# EAGLE design OPA1622 - Breakout (EAGLE 6.4)
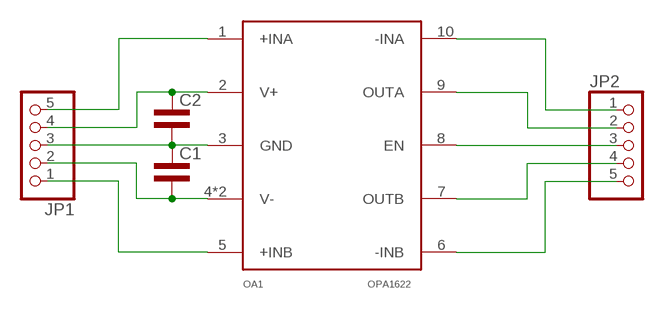
[diagram p0: schematic, sheet 1]

## Parts
C1  CAP0603L3  [0603L3]
C2  CAP0603L3  [0603L3]
JP1  PINHD-1X5  [1X05]
JP2  PINHD-1X5  [1X05]
OA1  OPA1622  [S-PVSON-N10]

## Nets
+INA: JP1.5 OA1.1(+INA)
+INB: JP1.1 OA1.5(+INB)
-INA: JP2.1 OA1.10(-INA)
-INB: JP2.5 OA1.6(-INB)
EN: JP2.3 OA1.8(EN)
GND: C1.P$1 C2.P$2 JP1.3 OA1.3(GND)
OUTA: JP2.2 OA1.9(OUTA)
OUTB: JP2.4 OA1.7(OUTB)
V+: C2.P$1 JP1.4 OA1.2(V+)
V-: C1.P$2 JP1.2 OA1.4(V-) OA1.TP(V-)

## Library data of the parts
C1 C2 = common:CAP
JP1 JP2 = pinhead:PINHD-1X5: PIN HEADER
OA1 = common:OPA1622

## Board
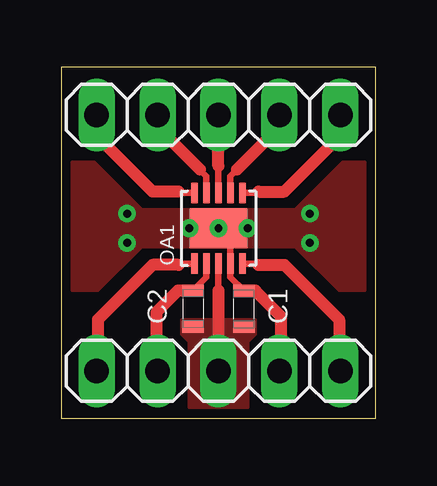
[diagram p1: board, top side]
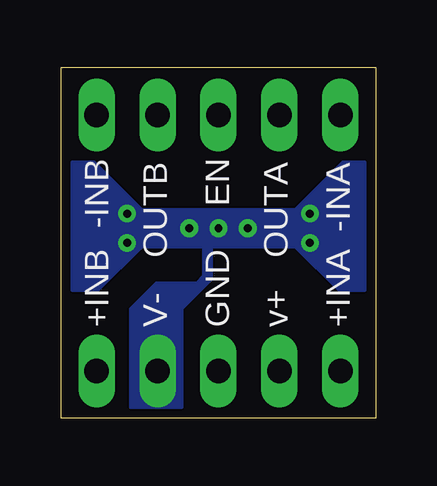
[diagram p2: board, bottom side, seen from below]

Size 13.11 x 14.63 mm. Coordinates in mm from the lower left corner, seen from the top.
Outline: 0,0 13.11,0 13.11,14.63 0,14.63 0,0
Copper layers (1*16): Top 0.035mm / dielectric 1.5mm / Bottom 0.035mm
Design rules "default *": minimum track width 10mil, minimum drill 24mil, track to track 8mil, track to pad 8mil, pad to pad 8mil, via to via 8mil, smd to smd 8mil, copper to edge 13mil, drill to drill 8mil, minimum pad ring 10mil, minimum via ring 8mil, stop-mask expansion 4mil, vias tented up to drill 0mil, thermal gap 10mil

### Footprints (pad centres in the part's own frame; a part is rotated, then mirrored left to right if it is on the bottom)
0603L3 = smd 0.5 x 0.9: P$1 -0.75,0; P$2 0.75,0
1X05 = drill 1.016 long: 1 -5.08,0; 2 -2.54,0; 3 0,0; 4 2.54,0; 5 5.08,0
S-PVSON-N10 = smd 0.28 x 0.85: 1 -1,-1.475; 2 -0.5,-1.475; 3 0,-1.475; 4 0.5,-1.475; 5 1,-1.475; 6 1,1.475; 7 0.5,1.475; 8 0,1.475; 9 -0.5,1.475; 10 -1,1.475 | smd 2.4 x 1.65: TP 0,0

### Placement (x,y rotation side)
C1  7.62,4.57 90 top
C2  5.49,4.57 270 top
JP1  6.55,1.98 180 top
JP2  6.55,12.65 0 top
OA1  6.55,7.92 0 top

### Tracks (layer width: path | path; a pad name or v marks a point on that pad's centre or on a via)
+INA
  Top 0.279: OA1.1 4.93,6.45 4.88,6.4
  Top 0.508: 4.88,6.4 3.81,6.4 1.52,4.12 1.52,2.03 JP1.5
+INB
  Top 0.279: OA1.5 8.18,6.45 8.23,6.4
  Top 0.508: 8.23,6.4 9.3,6.4 11.58,4.12 11.58,2.03 JP1.1
-INA
  Top 0.279: OA1.10 4.93,9.4 4.88,9.45
  Top 0.508: 4.88,9.45 3.81,9.45 1.52,11.74 1.52,12.6 JP2.1
-INB
  Top 0.279: OA1.6 8.18,9.4 8.23,9.45
  Top 0.508: 8.23,9.45 9.3,9.45 11.58,11.74 11.58,12.6 JP2.5
EN
  Top 0.279: OA1.8 6.55,10.52
  Top 0.508: 6.55,10.52 JP2.3
GND
  Top 0.279: OA1.3 6.55,5.33
  Top 0.508: 6.55,5.33 JP1.3
  pour Top (no thermals): 5.03,4.11 5.03,3.51 5.33,3.2 5.33,0.46 7.77,0.46 7.77,3.2 8.08,3.51 8.08,4.11
OUTA
  Top 0.279: OA1.9 6.05,10.1 5.79,10.36
  Top 0.508: 5.79,10.36 3.96,12.19 3.96,12.6 JP2.2
OUTB
  Top 0.279: OA1.7 7.05,10.1 7.32,10.36
  Top 0.508: 7.32,10.36 9.14,12.19 9.14,12.6 JP2.4
V+
  Top 0.279: OA1.2 6.05,5.89 C2.P$1
  Top 0.508: C2.P$1 4.86,5.32 3.96,4.42 3.96,2.03 JP1.4
V-  (via drill 0.33)
  Top 0.279: C1.P$2 7.05,5.89 OA1.4 7.05,7.43 OA1.TP
  Top 0.508: C1.P$2 8.09,5.32 9.14,4.27 9.14,2.03 JP1.2
  other vias: 2.74,8.53 2.74,7.32 5.33,7.92 6.55,7.92 7.77,7.92 10.36,8.53 10.36,7.32
  pour Top (no thermals): 3.35,8.69 9.75,8.69 11.73,10.67 12.65,10.67 12.65,5.33 11.58,5.33 9.75,7.16 3.35,7.16 1.52,5.33 0.46,5.33 0.46,10.67 1.37,10.67
  pour Bottom (no thermals): 8.08,0.46 8.08,4.57 6.86,5.79 6.86,7.16 3.35,7.16 1.52,5.33 0.46,5.33 0.46,10.67 1.37,10.67 3.35,8.69 9.75,8.69 11.73,10.67 12.65,10.67 12.65,5.33 11.58,5.33 9.75,7.16 7.16,7.16 7.16,5.94 7.47,5.64 9.14,5.64 10.21,4.57 10.21,0.46

### Text on the board
bPlace: EN | -INA | -INB | OUTA | OUTB | +INA | v+ | GND | V- | +INB